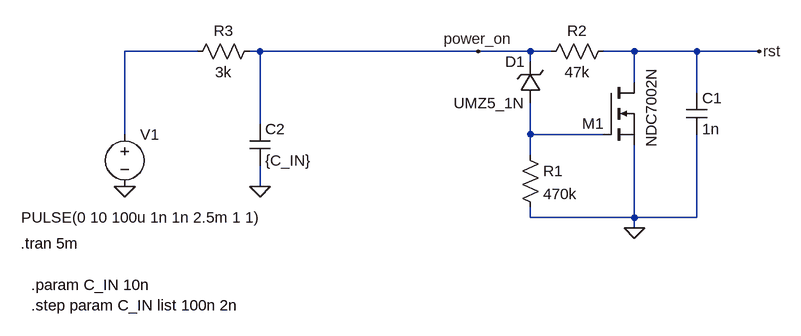
[diagram p0: schematic uvlo.asc]
uvlo.asc, the LTspice schematic file:
Version 4.1
SHEET 1 880 680
WIRE -192 96 -304 96
WIRE -96 96 -112 96
WIRE 240 96 -96 96
WIRE 320 96 240 96
WIRE 352 96 320 96
WIRE 480 96 432 96
WIRE 576 96 480 96
WIRE 672 96 576 96
WIRE 320 112 320 96
WIRE 480 144 480 96
WIRE 576 160 576 96
WIRE -96 208 -96 96
WIRE -304 224 -304 96
WIRE 320 224 320 176
WIRE 432 224 320 224
WIRE 320 256 320 224
WIRE -96 304 -96 272
WIRE 320 352 320 336
WIRE 480 352 480 240
WIRE 480 352 320 352
WIRE 576 352 576 224
WIRE 576 352 480 352
WIRE 480 368 480 352
FLAG 480 368 0
FLAG 240 96 power_on
FLAG 672 96 rst
FLAG -304 304 0
FLAG -96 304 0
SYMBOL zener 336 176 R180
WINDOW 0 24 64 Left 2
WINDOW 3 24 0 Left 2
SYMATTR InstName D1
SYMATTR Value UMZ5_1N
SYMBOL res 304 240 R0
SYMATTR InstName R1
SYMATTR Value 470k
SYMBOL res 448 80 R90
WINDOW 0 0 56 VBottom 2
WINDOW 3 32 56 VTop 2
SYMATTR InstName R2
SYMATTR Value 47k
SYMBOL cap 560 160 R0
SYMATTR InstName C1
SYMATTR Value 1n
SYMBOL nmos 432 144 R0
WINDOW 0 -32 63 Left 2
WINDOW 3 74 -23 VRight 2
SYMATTR InstName M1
SYMATTR Value NDC7002N
SYMBOL voltage -304 208 R0
WINDOW 3 -159 144 Left 2
WINDOW 123 0 0 Left 0
WINDOW 39 0 0 Left 0
SYMATTR Value PULSE(0 10 100u 1n 1n 2.5m 1 1)
SYMATTR InstName V1
SYMBOL res -96 80 R90
WINDOW 0 0 56 VBottom 2
WINDOW 3 32 56 VTop 2
SYMATTR InstName R3
SYMATTR Value 3k
SYMBOL cap -112 208 R0
SYMATTR InstName C2
SYMATTR Value {C_IN}
TEXT -464 392 Left 2 !.tran 5m
TEXT -448 456 Left 2 !.param C_IN 10n\n.step param C_IN list 100n 2n

The netlist it stands for:
* uvlo.asc
D1 N002 power_on UMZ5_1N
R1 N002 0 470k
R2 rst power_on 47k
C1 rst 0 1n
M1 rst N002 0 0 NDC7002N
V1 N001 0 PULSE(0 10 100u 1n 1n 2.5m 1 1)
R3 power_on N001 3k
C2 power_on 0 {C_IN}
.model D D
.lib standard.dio
.model NMOS NMOS
.model PMOS PMOS
.lib standard.mos
.tran 5m
.param C_IN 10n
.step param C_IN list 100n 2n
.backanno
.end